# EAGLE design RADIO (EAGLE 9.4.2)
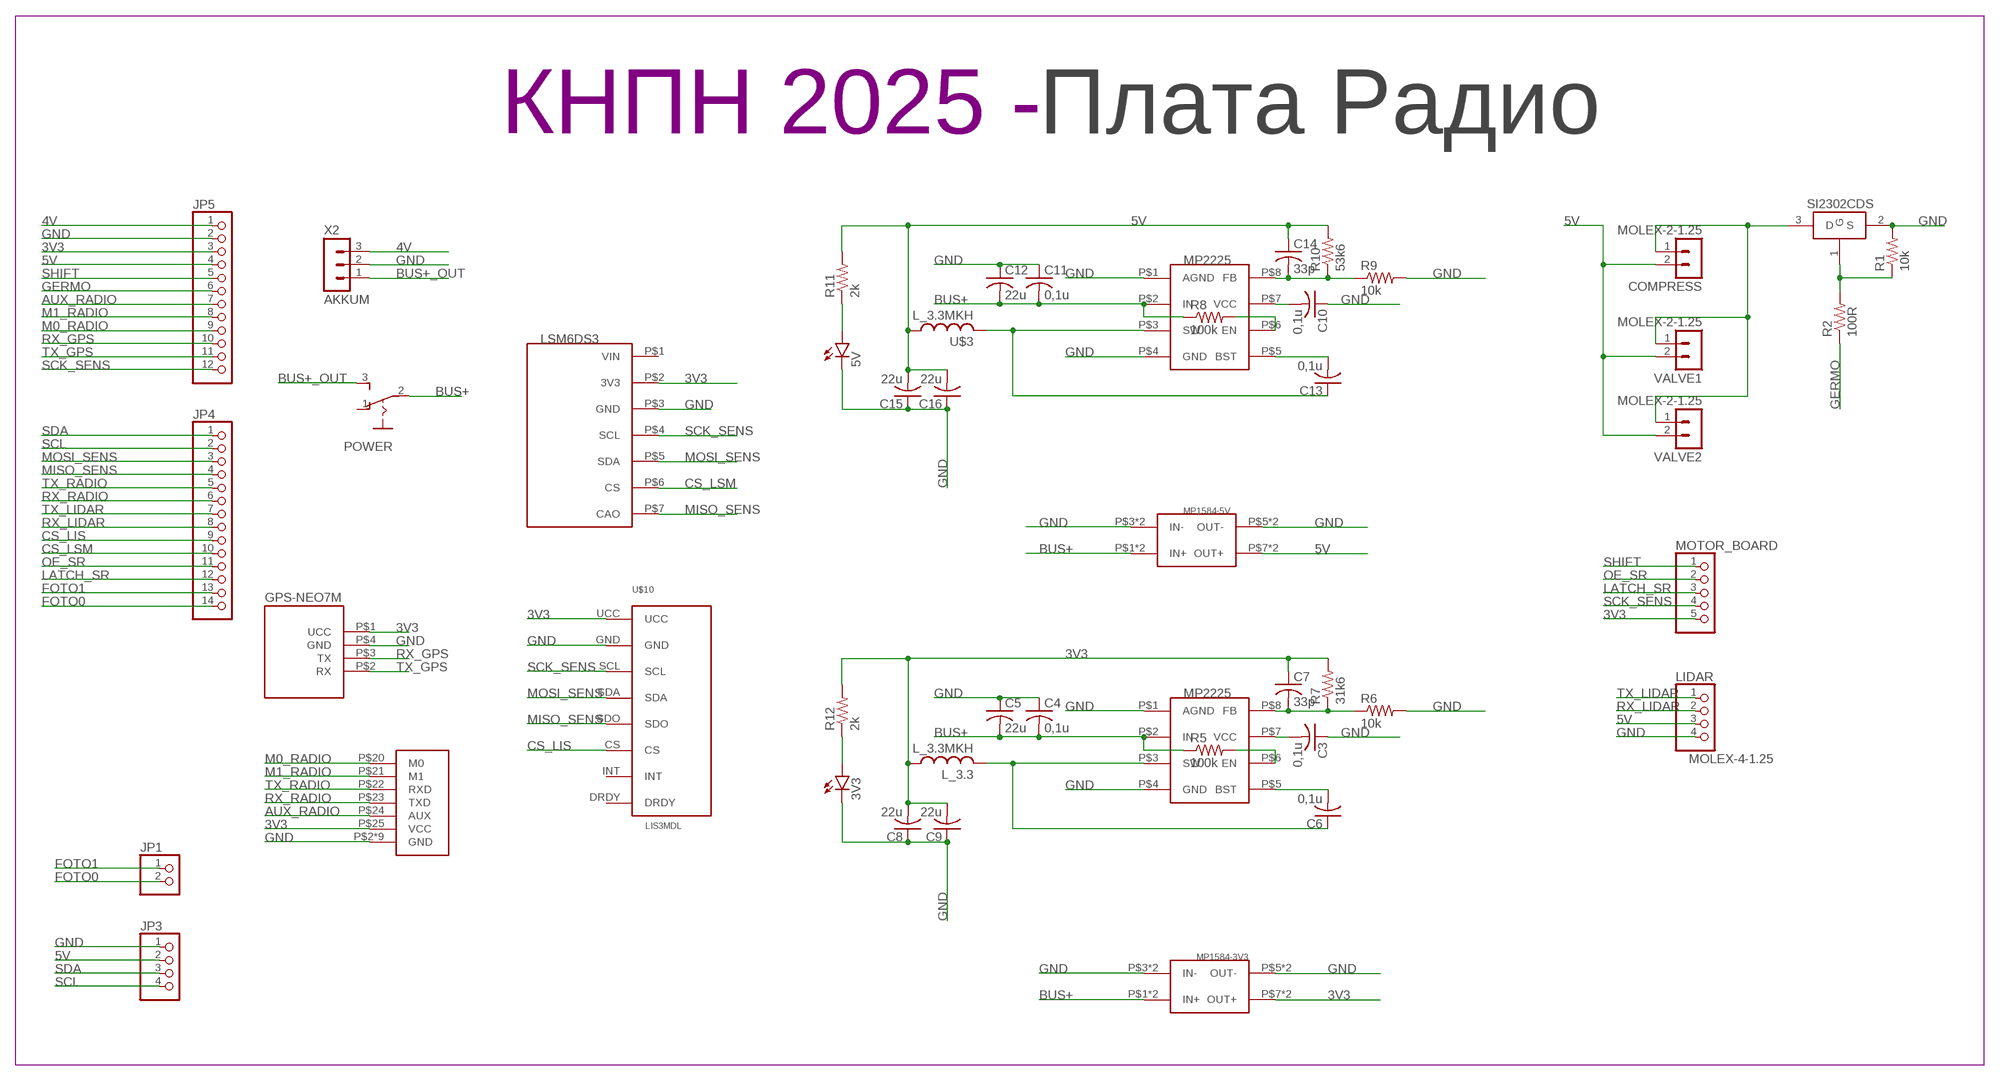
[diagram p0: schematic, sheet 1]

## Parts
3V3  LEDCHIP-LED0603  [CHIP-LED0603]
5V  LEDCHIP-LED0603  [CHIP-LED0603]
C3  0,1u  C-USC0603  [C0603]
C4  0,1u  C-USC1206  [C1206]
C5  22u  C-USC0603  [C0603]
C6  0,1u  C-USC0603  [C0603]
C7  33p  C-USC0603  [C0603]
C8  22u  C-USC1206  [C1206]
C9  22u  C-USC1206  [C1206]
C10  0,1u  C-USC0603  [C0603]
C11  0,1u  C-USC1206  [C1206]
C12  22u  C-USC0603  [C0603]
C13  0,1u  C-USC0603  [C0603]
C14  33p  C-USC0603  [C0603]
C15  22u  C-USC1206  [C1206]
C16  22u  C-USC1206  [C1206]
COMPRESS  MOLEX-2-1.25  [53047-02]
GPS-NEO7M  GPS-NEO7M  [GPS-NEO7M]
JP1  PINHD-1X2  [1X02]
JP3  PINHD-1X4  [1X04]
JP4  PINHD-1X14  [1X14]
JP5  PINHD-1X12  [1X12]
L_3.3  L_3.3MKH  L_3.3MKH_5X5  [L_SPM5020]
LIDAR  MOLEX-4-1.25  [53047-04]
LSM6DS3  LSM6DS3  LSM6DS3_WITHOUT  [LSM6DS3_WITHOUT]
MOTOR_BOARD  MOLEX-5-1.25  [53047-05]
MP1584-3V3  MP1584-B  [MP1584-B]
MP1584-5V  MP1584  MP1584-B  [MP1584-B]
POWER  UNICS-SWITCHSS_12D11  [SS_12D11]
R1  10k  R-US_R0603  [R0603]
R2  100R  R-US_R0603  [R0603]
R5  100k  R-US_R0603  [R0603]
R6  10k  R-US_R0603  [R0603]
R7  31k6  R-US_R0603  [R0603]
R8  100k  R-US_R0603  [R0603]
R9  10k  R-US_R0603  [R0603]
R10  53k6  R-US_R0603  [R0603]
R11  2k  R-US_R0603  [R0603]
R12  2k  R-US_R0603  [R0603]
RADIO  E220-400T22S  [E220-400T22S]
SI2302  SI2302CDS  [SOT23-3]
U$1  Плата Радио  LOGOPCB-""  [LOGO]
U$2  MP2225  [TSOT23-8]
U$3  L_3.3MKH  L_3.3MKH_5X5  [L_SPM5020]
U$5  MP2225  [TSOT23-8]
U$10  LIS3MDL  [LIS3MDL]
VALVE1  MOLEX-2-1.25  [53047-02]
VALVE2  MOLEX-2-1.25  [53047-02]
X2  AKKUM  JST-3-2.5  [JST-3-2.5]

## Nets
3V3: C7.1 C8.2 C9.2 GPS-NEO7M.P$1(UCC) JP5.3 L_3.3.P$1 LSM6DS3.P$2(3V3) MOTOR_BOARD.5 MP1584-3V3.P$7(OUT+) MP1584-3V3.P$8(OUT+) R7.2 R12.2 RADIO.P$25(VCC) U$10.UCC
4V: JP5.1 X2.3
5V: C14.1 C15.2 C16.2 COMPRESS.2 JP3.2 JP5.4 LIDAR.3 MP1584-5V.P$7(OUT+) MP1584-5V.P$8(OUT+) R10.2 R11.2 U$3.P$1 VALVE1.2 VALVE2.2
AUX_RADIO: JP5.7 RADIO.P$24(AUX)
BUS+: C4.2 C5.2 C11.2 C12.2 MP1584-3V3.P$1(IN+) MP1584-3V3.P$2(IN+) MP1584-5V.P$1(IN+) MP1584-5V.P$2(IN+) POWER.2(P) R5.1 R8.1 U$2.P$2(IN) U$5.P$2(IN)
BUS+_OUT: POWER.3(S) X2.1
CS_LIS: JP4.9 U$10.CS
CS_LSM: JP4.10 LSM6DS3.P$6(CS)
FOTO0: JP1.2 JP4.14
FOTO1: JP1.1 JP4.13
GERMO: JP5.6 R2.1
GND: 3V3.C 5V.C C3.1 C4.1 C5.1 C8.1 C9.1 C10.1 C11.1 C12.1 C15.1 C16.1 GPS-NEO7M.P$4(GND) JP3.1 JP5.2 LIDAR.4 LSM6DS3.P$3(GND) MP1584-3V3.P$3(IN-) MP1584-3V3.P$4(IN-) MP1584-3V3.P$5(OUT-) MP1584-3V3.P$6(OUT-) MP1584-5V.P$3(IN-) MP1584-5V.P$4(IN-) MP1584-5V.P$5(OUT-) MP1584-5V.P$6(OUT-) R1.2 R6.2 R9.2 RADIO.P$2(GND) RADIO.P$8(GND) RADIO.P$11(GND) RADIO.P$13(GND) RADIO.P$14(GND) RADIO.P$15(GND) RADIO.P$16(GND) RADIO.P$19(GND) RADIO.P$26(GND) SI2302.2(S) U$2.P$1(AGND) U$2.P$4(GND) U$5.P$1(AGND) U$5.P$4(GND) U$10.GND X2.2
LATCH_SR: JP4.12 MOTOR_BOARD.3
M0_RADIO: JP5.9 RADIO.P$20(M0)
M1_RADIO: JP5.8 RADIO.P$21(M1)
MISO_SENS: JP4.4 LSM6DS3.P$7(CAO) U$10.SDO
MOSI_SENS: JP4.3 LSM6DS3.P$5(SDA) U$10.SDA
N$2: R1.1 R2.2 SI2302.1(G)
N$5: COMPRESS.1 SI2302.3(D) VALVE1.1 VALVE2.1
N$9: C3.2 U$2.P$7(VCC)
N$10: R5.2 U$2.P$6(EN)
N$11: C6.2 U$2.P$5(BST)
N$12: C6.1 L_3.3.P$2 U$2.P$3(SW)
N$13: C7.2 R6.1 R7.1 U$2.P$8(FB)
N$14: C10.2 U$5.P$7(VCC)
N$15: R8.2 U$5.P$6(EN)
N$16: C13.2 U$5.P$5(BST)
N$17: C13.1 U$3.P$2 U$5.P$3(SW)
N$18: C14.2 R9.1 R10.1 U$5.P$8(FB)
N$19: 5V.A R11.1
N$20: 3V3.A R12.1
OE_SR: JP4.11 MOTOR_BOARD.2
RX_GPS: GPS-NEO7M.P$3(TX) JP5.10
RX_LIDAR: JP4.8 LIDAR.2
RX_RADIO: JP4.6 RADIO.P$23(TXD)
SCK_SENS: JP5.12 LSM6DS3.P$4(SCL) MOTOR_BOARD.4 U$10.SCL
SCL: JP3.4 JP4.2
SDA: JP3.3 JP4.1
SHIFT: JP5.5 MOTOR_BOARD.1
TX_GPS: GPS-NEO7M.P$2(RX) JP5.11
TX_LIDAR: JP4.7 LIDAR.1
TX_RADIO: JP4.5 RADIO.P$22(RXD)
Unconnected: LSM6DS3.P$1(VIN) POWER.1(O) U$10.DRDY U$10.INT

## Library data of the parts
3V3 5V = led:LED: LED OSRAM: - CHIPLED LG R971, LG N971, LY N971, LG Q971, LY Q971, LO R971, LY R971 LH N974, LH R974 LS Q976, LO Q976, LY Q976 LO Q996 - Hyper CHIPLED LW Q18S LB Q993, LB Q99A, LB R99A - SideLED LS A670, LO A670, LY A670, LG A670, LP A670 LB A673, LV A673, LT A673, LW A673 LH A674 LY A675 LS A676, LA A676, LO A676, LY A676, LW A676 LS A679, LY A679, LG A679 - Hyper Micro SIDELED® LS Y876, LA Y876, LO Y876, LY Y876 LT Y87S - SmartLED LW L88C, LW L88S LB L89C, LB L89S, LG L890 LS L89K, LO L89K, LY L89K LS L896, LA L896, LO L896, LY L896 - TOPLED LS T670, LO T670, LY T670, LG T670, LP T670 LSG T670, LSP T670, LSY T670, LOP T670, LYG T670 LG T671, LOG T671, LSG T671 LB T673, LV T673, LT T673, LW T673 LH T674 LS T676, LA T676, LO T676, LY T676, LB T676, LH T676, LSB T676, LW T676 LB T67C, LV T67C, LT T67C, LS T67K, LO T67K, LY T67K, LW E67C LS E67B, LA E67B, LO E67B, LY E67B, LB E67C, LV E67C, LT E67C LW T67C LS T679, LY T679, LG T679 LS T770, LO T770, LY T770, LG T770, LP T770 LB T773, LV T773, LT T773, LW T773 LH T774 LS E675, LA E675, LY E675, LS T675 LS T776, LA T776, LO T776, LY T776, LB T776 LHGB T686 LT T68C, LB T68C - Hyper Mini TOPLED® LB M676 - Mini TOPLED Santana® LG M470 LS M47K, LO M47K, LY M47K Source: http://www.osram.convergy.de LUXEON: - LUMILED® LXK2-PW12-R00, LXK2-PW12-S00, LXK2-PW14-U00, LXK2-PW14-V00 LXK2-PM12-R00, LXK2-PM12-S00, LXK2-PM14-U00 LXK2-PE12-Q00, LXK2-PE12-R00, LXK2-PE12-S00, LXK2-PE14-T00, LXK2-PE14-U00 LXK2-PB12-K00, LXK2-PB12-L00, LXK2-PB12-M00, LXK2-PB14-N00, LXK2-PB14-P00, LXK2-PB14-Q00 LXK2-PR12-L00, LXK2-PR12-M00, LXK2-PR14-Q00, LXK2-PR14-R00 LXK2-PD12-Q00, LXK2-PD12-R00, LXK2-PD12-S00 LXK2-PH12-R00, LXK2-PH12-S00 LXK2-PL12-P00, LXK2-PL12-Q00, LXK2-PL12-R00 Source: www.luxeon.com KINGBRIGHT: KA-3528ASYC Source: www.kingbright.com
C3-C16 = rcl:C-US: CAPACITOR, American symbol; SPICEPREFIX: C
COMPRESS VALVE1 VALVE2 = UNKNOWN-2024:MOLEX-2-1.25
GPS-NEO7M = UNKNOWN-2024:GPS-NEO7M
JP1 = pinhead:PINHD-1X2: PIN HEADER
JP3 = pinhead:PINHD-1X4: PIN HEADER
JP4 = pinhead:PINHD-1X14: PIN HEADER
JP5 = pinhead:PINHD-1X12: PIN HEADER
L_3.3 U$3 = CanCubeSat:L_3.3MKH_5X5
LIDAR = UNKNOWN-2024:MOLEX-4-1.25
LSM6DS3 = UNKNOWN-2024:LSM6DS3_WITHOUT
MOTOR_BOARD = UNKNOWN-2024:MOLEX-5-1.25
MP1584-3V3 MP1584-5V = UNKNOWN-2024:MP1584-B
POWER = UNKNOWN-2024:UNICS-SWITCH: SLIDING SWITCH Distributor Buerklin, 11G810
R1 R2 R5-R12 = rcl:R-US_: RESISTOR, American symbol; SPICEPREFIX: R
RADIO = UNKNOWN-2024:E220-400T22S
SI2302 = CanCubeSat:SI2302CDS
U$1 = UNKNOWN-2024:LOGO
U$2 U$5 = UNKNOWN-2024:MP2225
U$10 = UNKNOWN-2024:LIS3MDL
X2 = UNKNOWN-2024:JST-3-2.5

## Board
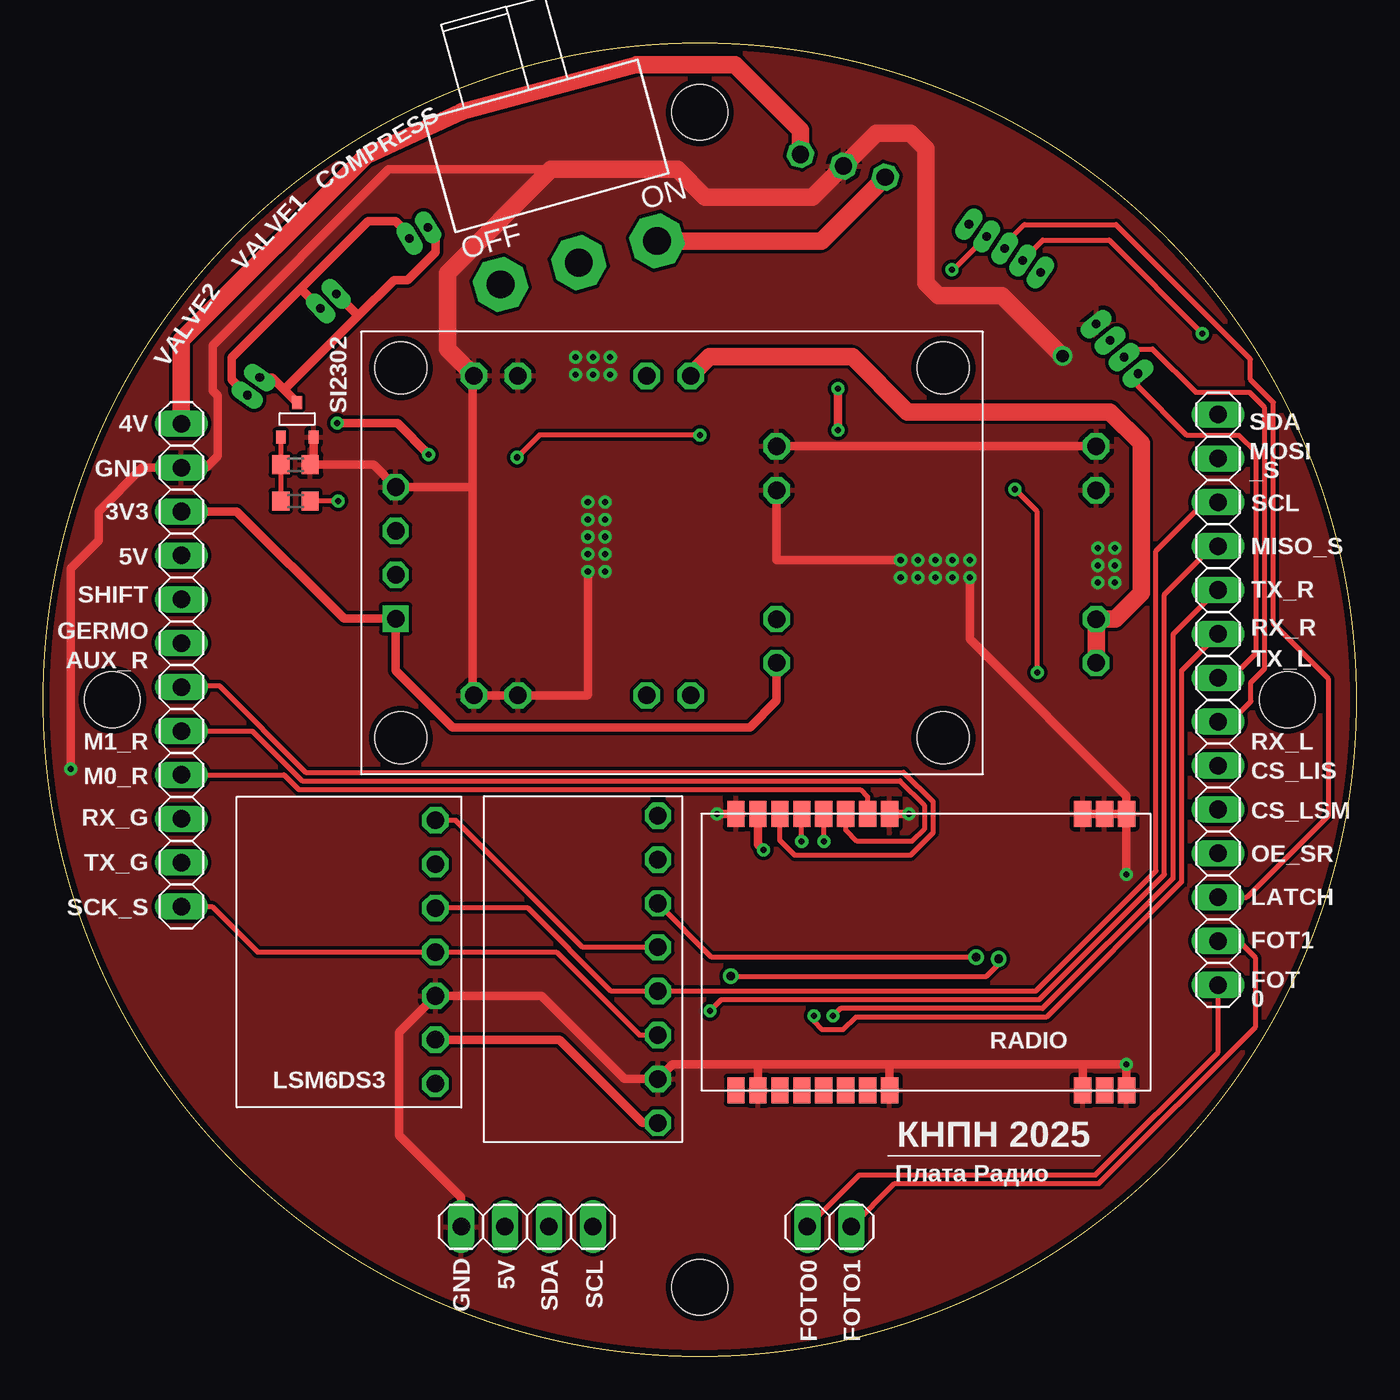
[diagram p1: board, top side]
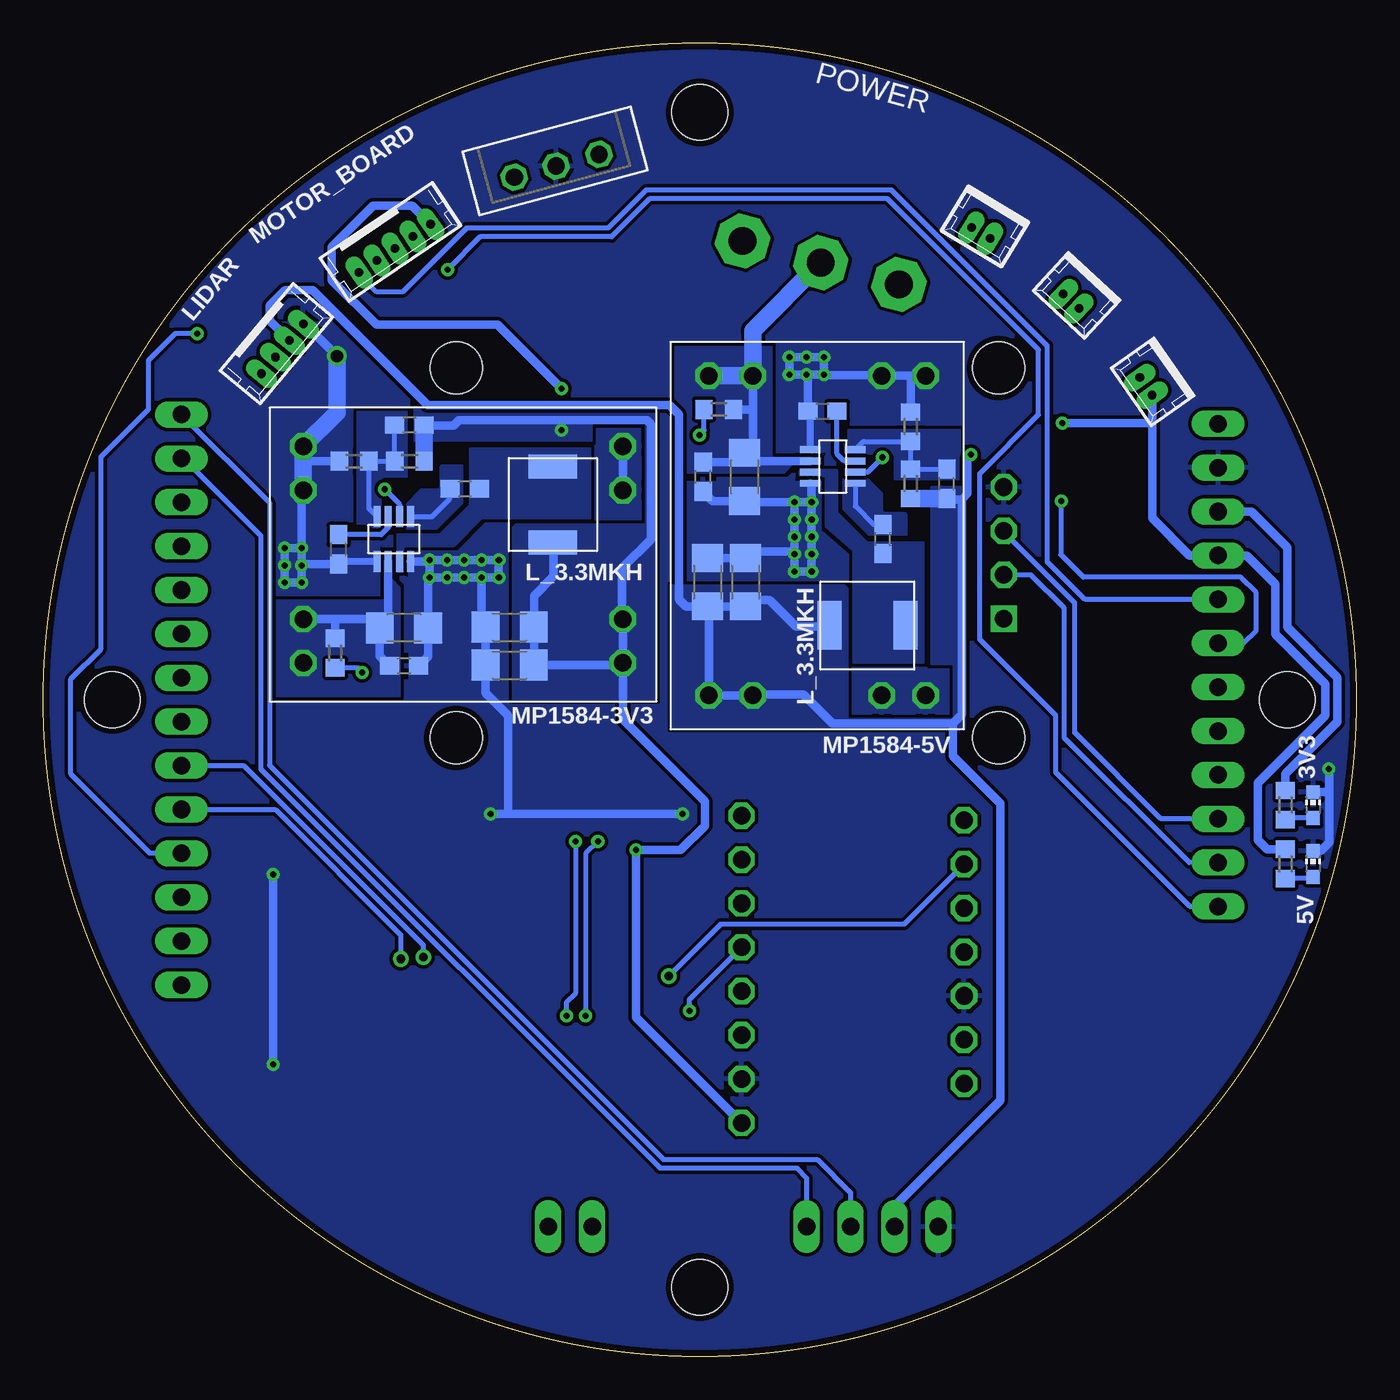
[diagram p2: board, bottom side, seen from below]

Size 76 x 76 mm. Coordinates in mm from the lower left corner, seen from the top.
Outline: circle at 38,38 radius 38
Copper layers (1*16): Top 0.035mm / dielectric 1.5mm / Bottom 0.035mm
Design rules "default *": minimum track width 0.3mm, minimum drill 0.35mm, track to track 0.2mm, track to pad 0.2mm, pad to pad 0.2mm, via to via 0.2mm, smd to smd 0.2mm, copper to edge 0.35mm, drill to drill 0.2mm, minimum pad ring 10mil, minimum via ring 8mil, stop-mask expansion 4mil, vias tented up to drill 0mil, thermal gap 10mil
Holes 3.2 mm at 38,72 72,38 38,4 4,38

### Footprints (pad centres in the part's own frame; a part is rotated, then mirrored left to right if it is on the bottom)
CHIP-LED0603 = smd 0.8 x 0.8: A 0,-0.75; C 0,0.75
C0603 = smd 1.1 x 1: 1 -0.85,0; 2 0.85,0
C1206 = smd 1.6 x 1.8: 1 -1.4,0; 2 1.4,0
53047-02 = drill 0.5 pad 0.698 long: 1 0.625,0.45; 2 -0.625,0.45
GPS-NEO7M = drill 1.016 square: P$1 -3.81,16 | drill 1.016 octagon: P$2 -1.27,16; P$3 1.27,16; P$4 3.81,16 | hole 3: -10.7,15.7; 10.7,15.7; 10.7,-15.7; -10.7,-15.7
1X02 = drill 1.016 long: 1 -1.27,0; 2 1.27,0
1X04 = drill 1.016 long: 1 -3.81,0; 2 -1.27,0; 3 1.27,0; 4 3.81,0
1X14 = drill 1.016 long: 1 -16.51,0; 2 -13.97,0; 3 -11.43,0; 4 -8.89,0; 5 -6.35,0; 6 -3.81,0; 7 -1.27,0; 8 1.27,0; 9 3.81,0; 10 6.35,0; 11 8.89,0; 12 11.43,0; 13 13.97,0; 14 16.51,0
1X12 = drill 1.016 long: 1 -13.97,0; 2 -11.43,0; 3 -8.89,0; 4 -6.35,0; 5 -3.81,0; 6 -1.27,0; 7 1.27,0; 8 3.81,0; 9 6.35,0; 10 8.89,0; 11 11.43,0; 12 13.97,0
L_SPM5020 = smd 1.4 x 2.8: P$1 -2.2,0; P$2 2.2,0
53047-04 = drill 0.5 pad 0.698 long: 1 1.875,0.45; 2 0.625,0.45; 3 -0.625,0.45; 4 -1.875,0.45
LSM6DS3_WITHOUT = drill 1.016 octagon: P$1 -7.62,-5; P$2 -5.08,-5; P$3 -2.54,-5; P$4 0,-5; P$5 2.54,-5; P$6 5.08,-5; P$7 7.62,-5
53047-05 = drill 0.5 pad 0.698 long: 1 2.5,0.45; 2 1.25,0.45; 3 0,0.45; 4 -1.25,0.45; 5 -2.5,0.45
MP1584-B = drill 1.016 octagon: P$1 -9.25,-6.27; P$2 -9.25,-3.73; P$3 -9.25,3.73; P$4 -9.25,6.27; P$5 9.25,6.27; P$6 9.25,3.73; P$7 9.25,-3.73; P$8 9.25,-6.27
SS_12D11 = drill 1.6 pad 3 octagon: 1 -4.7,0; 2 0,0; 3 4.7,0
R0603 = smd 1 x 1.1: 1 -0.85,0; 2 0.85,0
E220-400T22S = smd 1.5 x 1: P$1 -8,11; P$2 -8,9.73; P$3 -8,8.46; P$4 -8,7.19; P$5 -8,5.92; P$6 -8,4.65; P$7 -8,3.38; P$8 -8,2.11; P$11 -8,-9.06; P$12 -8,-10.33; P$13 -8,-11.6; P$14 8,-11.6; P$15 8,-10.33; P$16 8,-9.06; P$19 8,2.11; P$20 8,3.38; P$21 8,4.65; P$22 8,5.92; P$23 8,7.19; P$24 8,8.46; P$25 8,9.73; P$26 8,11
SOT23-3 = smd 0.56 x 0.73: 1 -0.95,-1; 2 0.95,-1; 3 0,1
TSOT23-8 = smd 0.4 x 1.2: P$1 -0.975,-1.3; P$2 -0.325,-1.3; P$3 0.325,-1.3; P$4 0.975,-1.3; P$5 0.975,1.3; P$6 0.325,1.3; P$7 -0.325,1.3; P$8 -0.975,1.3
LIS3MDL = drill 1.016 octagon: CS -5.08,-3.81; DRDY -5.08,-8.89; GND -5.08,6.35; INT -5.08,-6.35; SCL -5.08,3.81; SDA -5.08,1.27; SDO -5.08,-1.27; UCC -5.08,8.89
JST-3-2.5 = drill 1 pad 1.5 octagon: 1 2.52,0; 2 0.02,0; 3 -2.56,0

### Placement (x,y rotation side)
3V3  2.5,31.9 0 bottom
5V  2.5,28.5 0 bottom
C3  58.9,46.7 90 bottom
C4  35.4,50.9 90 bottom
C5  37.8,50.9 90 bottom
C6  51.6,50.2 180 bottom
C7  54.8,53.9 180 bottom
C8  49,42.2 0 bottom
C9  49,40 0 bottom
C10  30.9,54.7 0 bottom
C11  55.12,42.16 180 bottom
C12  55.11,39.96 180 bottom
C13  27.4,47.3 90 bottom
C14  23.7,50.5 90 bottom
C15  37.55,44.8 270 bottom
C16  35.35,44.8 270 bottom
COMPRESS  21.5,65.4 149 bottom
GPS-NEO7M  36.4,46.5 90 top
JP1  45.5,7.5 180 top
JP3  28,7.5 0 top
JP4  68,38 270 top
JP5  8,40 270 top
L_3.3  46.5,49.3 90 bottom
LIDAR  62.5,58.6 230 bottom
LSM6DS3  17.7,23.4 90 top
MOTOR_BOARD  55.9,64.5 214 bottom
MP1584-3V3  51.7,46.4 0 bottom
MP1584-5V  31.2,47.5 270 bottom
POWER  31,63.3 15.5 top
R1  14.6,51.6 0 top
R2  14.6,49.5 180 top
R5  59.1,40.7 270 bottom
R6  58,51.8 180 bottom
R7  54.8,51.8 0 bottom
R8  36.9,54.8 180 bottom
R9  25.8,53.8 90 bottom
R10  25.8,50.5 270 bottom
R11  4.1,28.5 90 bottom
R12  4.1,31.9 90 bottom
RADIO  51.1,23.4 90 top
SI2302  14.7,54.2 0 top
U$1  48.9,11.6 0 top
U$2  55.7,47.3 0 bottom
U$3  28.3,42.3 0 bottom
U$5  30.3,51.5 270 bottom
U$10  30.5,22.4 180 top
VALVE1  16.2,61.4 137 bottom
VALVE2  11.8,56.4 125 bottom
X2  46.3,68.9 195 bottom

### Tracks (layer width: path | path; a pad name or v marks a point on that pad's centre or on a via)
3V3  (via drill 0.35)
  Top 0.5: LSM6DS3.P$2 29.88,18.32 34.69,13.51 U$10.UCC | v41.7,29.3 41.37,29.63 RADIO.P$25 | JP5.3 11.21,48.89 17.41,42.69 GPS-NEO7M.P$1 20.4,39.7 23.7,36.4 40.9,36.4 42.45,37.95 MP1584-3V3.P$8 | v46,53.6 v46,56
  Bottom 0.5: 46,54.18 41.05,54.18 40.83,53.96 40.83,47.28 42.5,45.61 42.5,42.72 MP1584-3V3.P$7 MP1584-3V3.P$8 | 46,54.18 51.93,54.18 52.25,53.86 53.91,53.86 C7.1 | R12.2 4.1,33.7 1.1,36.7 1.1,39.3 4,42.2 4,46.8 6.09,48.89 JP5.3 | U$10.UCC 41.7,19.63 v41.7,29.3 39.1,29.3 37.7,30.7 37.7,32.1 42.45,36.85 MP1584-3V3.P$8 | MOTOR_BOARD.5 54.65,66.6 56.9,66.6 59.3,64.2 59.3,62.3 56.7,59.7 49.7,59.7 v46,56 | 46,54.18 v46,53.6 | L_3.3.P$1 46.45,47.05 46.45,45.16 47.6,44.01 C8.2 C9.2 42.58,40 MP1584-3V3.P$8
  Bottom 1: R7.2 C7.1
  pour Bottom (rank 2, no thermals): 48.83,47.98 48.83,37.98 40.53,37.98 40.53,54.98 54.53,54.98 54.53,52.98 44.23,52.98 44.23,54.28 41.13,54.28 41.13,48.18 48.63,48.18
4V
  Top 1: X2.3 43.83,70.97 40.04,74.76 34.34,74.76 24.21,72.04 18.65,69.45 8,58.8 JP5.1
5V  (via drill 0.35)
  Top 0.5: VALVE2.2 10.9,56.54 10.9,57.8 14.9,61.8 | COMPRESS.2 21.2,64.9 20.4,65.7 18.8,65.7 14.9,61.8 | VALVE1.2 14.9,61.79 14.9,61.8 | v17,54 20.5,54 v22.3,52.2
  Bottom 0.5: R11.2 5.15,29.35 5.7,29.9 5.7,33.19 1.8,37.09 1.8,38.91 4.7,41.81 4.7,44.7 6.35,46.35 JP5.4 9.65,46.35 11.81,48.51 11.81,54 | C15.2 38.8,43.4 39.2,43.8 39.2,54.5 39.75,55.05 53.75,55.05 60.4,61.7 62,61.7 62.9,60.8 62.9,59.94 LIDAR.3 | JP3.2 26.73,8.67 20.6,14.8 20.6,32 23.35,34.75 23.35,36.62 | 11.81,54 VALVE2.2 | 22.82,49.6 22.82,37.15 23.35,36.62 | 11.81,54 v17,54 | v22.3,52.2 22.5,52 22.5,49.92 22.82,49.6 | C15.2 C16.2 34.98,43.77 33.96,43.77 32.44,42.25 30.55,42.25 U$3.P$1 | C15.2 37.47,43.32 MP1584-5V.P$8 MP1584-5V.P$7 34.88,38.3 31.99,38.3 30.32,36.63 24.42,36.63 24.43,36.62 23.35,36.62 | 22.82,49.6 23.65,49.6 C14.1
  Bottom 1: C14.1 R10.2
  pour Bottom (rank 2, no thermals): 29.62,44.63 39.62,44.63 39.62,36.33 22.62,36.33 22.62,50.33 24.62,50.33 24.62,40.03 23.32,40.03 23.32,36.93 29.42,36.93 29.42,44.43
AUX_RADIO
  Top 0.3: JP5.7 8.07,38.8 10.2,38.8 15.2,33.8 49.8,33.8 51.5,32.1 51.5,30.3 50.2,29 43.5,29 42.64,29.86 RADIO.P$24
BUS+
  Top 1: MP1584-3V3.P$1 MP1584-3V3.P$2 62.05,42.67 63.55,44.16 63.55,52.85 61.75,54.65 50.03,54.65 46.83,57.85 38.57,57.85 MP1584-5V.P$1
  Bottom 0.5: MP1584-3V3.P$2 59.1,42.67 | R5.1 59.1,42.67 | C12.2 56.52,40.52 C11.2 | 59.1,42.67 57.03,42.67 C11.2 | U$2.P$2 56.02,42.66 C11.2 | U$5.P$2 34.92,51.83 C4.2 | C5.2 35.95,51.75 C4.2 | MP1584-5V.P$2 34.93,54.8 | 34.93,54.8 34.93,52.77 C4.2 | R8.1 34.93,54.8
  Bottom 1: POWER.2 34.93,59.37 MP1584-5V.P$2 MP1584-5V.P$1
  pour Bottom (rank 2, no thermals): 62.63,43.78 62.63,38.18 55.33,38.18 55.33,44.48 55.83,44.98 55.83,46.58 56.23,46.58 56.23,43.78
  pour Bottom (rank 2, no thermals): 33.82,58.43 39.42,58.43 39.42,51.13 33.12,51.13 32.62,51.63 31.02,51.63 31.02,52.03 33.82,52.03
BUS+_OUT
  Top 1: POWER.3 45.04,64.56 X2.1
CS_LIS  (via drill 0.5)
  Top 0.3: v54,23.1 38.69,23.1 U$10.CS
  Bottom 0.3: v54,23.1 54,23.8 64.39,34.19 JP4.9
CS_LSM  (via drill 0.5)
  Top 0.3: v39.8,22 54.6,22 55.3,22.7 v55.3,23
  Bottom 0.3: LSM6DS3.P$6 26.18,25 36.8,25 v39.8,22 | v55.3,23 55.3,24.39 62.56,31.65 JP4.10
FOTO0
  Top 0.3: JP1.2 47.23,10.5 60.9,10.5 68,17.6 JP4.14
FOTO1
  Top 0.3: JP1.1 49.27,10 61.11,10 70.17,19.07 70.17,23.05 69.19,24.03 JP4.13
GERMO  (via drill 0.35)
  Top 0.3: v17.07,49.5 R2.1
  Bottom 0.3: JP5.6 6.53,41.27 5.8,42 5.8,44.2 6.7,45.1 15.8,45.1 17.1,46.4 17.1,49.47 v17.07,49.5
GND  (via drill 0.35, 0.7)
  Top 0.5: v49.63,46.08 42.43,46.08 42.43,50.11 MP1584-3V3.P$6 | v31.52,45.43 31.52,38.3 31.47,38.25 MP1584-5V.P$6 MP1584-5V.P$5 24.85,38.33 24.85,50.3 24.84,50.31 | RADIO.P$14 RADIO.P$15 RADIO.P$16 | SI2302.2 15.65,51.8 R1.2 19.11,51.6 GPS-NEO7M.P$4 24.84,50.31 | RADIO.P$19 v50.1,31.4 | v39,31.4 RADIO.P$26 | JP3.1 24.19,9.21 20.6,12.8 20.6,18.76 LSM6DS3.P$3 28.84,20.86 33.65,16.05 U$10.GND 36.43,16.9 41.4,16.9 | v1.6,34 1.6,45.6 3.2,47.2 3.2,48.9 5.73,51.43 JP5.2 9.43,51.43 10.1,52.1 10.1,55.6 9.8,55.9 9.8,58.5 20,68.7 29.4,68.7 | RADIO.P$14 v62.7,27.9 | MP1584-3V3.P$5 MP1584-3V3.P$4 | RADIO.P$13 v62.7,16.9 60.2,16.9 | 60.2,16.9 49,16.9 | 49,16.9 41.4,16.9 | RADIO.P$11 60.16,16.86 60.2,16.9 | RADIO.P$8 48.99,16.89 49,16.9 | RADIO.P$2 41.37,16.87 41.4,16.9 | 24.84,50.31 24.84,56.66 MP1584-5V.P$4 | RADIO.P$14 62.7,32.44 53.63,41.51 v53.63,45.08
  Top 1: MP1584-5V.P$4 23.4,58.28 23.4,62.7 29.4,68.7 36.7,68.7 38.3,67.1 44.52,67.1 X2.2 48.22,70.8 50.2,70.8 51.1,69.9 51.1,62.1 51.8,61.4 55.5,61.4 v59,57.9
  Bottom 0.4: U$2.P$1 58.75,46 | U$5.P$1 31.6,54.55
  Bottom 0.5: v50.63,45.08 v49.63,45.08 v49.63,46.08 v50.63,46.08 v51.63,46.08 v52.63,46.08 v53.63,46.08 | v53.63,45.08 v53.63,46.08 | v50.63,45.08 v51.63,45.08 v52.63,45.08 v53.63,45.08 | v61.03,45.78 v61.03,44.78 v62.03,44.78 v62.03,45.78 v62.03,46.78 v61.03,46.78 | v61.03,45.78 v61.03,46.78 | v32.52,46.43 32.66,46.57 34.98,46.57 C16.1 C15.1 | v32.52,46.43 v32.52,45.43 v31.52,45.43 v31.52,46.43 v31.52,47.43 v31.52,48.43 v31.52,49.43 | v32.52,49.43 v31.52,49.43 | v32.52,46.43 v32.52,47.43 v32.52,48.43 v32.52,49.43 | v31.82,56.83 v32.82,56.83 v32.82,57.83 v31.82,57.83 v30.82,57.83 v30.82,56.83 | v31.82,56.83 v30.82,56.83 | v30.82,56.83 30.77,56.78 27.5,56.78 MP1584-5V.P$3 25.79,56.75 | v50.1,31.4 49.1,31.4 | 49.1,31.4 v39,31.4 | 5V.C 2.05,29.25 1.56,29.73 1.56,32.65 | 3V3.C 1.56,32.65 | R9.2 25.79,56.75 | v59,57.9 60.85,59.75 LIDAR.4 | 1.56,32.65 1.56,33.97 v1.6,34 | 49.1,31.4 49.1,37.1 50.4,38.4 C9.1 C8.1 50.63,42.43 v50.63,45.08 | v62.7,27.9 v62.7,16.9 | C5.1 37.25,49.5 C4.1 35.33,49.43 v32.52,49.43 | R6.2 60.95,51.8 | v61.03,46.78 61.03,50.05 MP1584-3V3.P$3 | v61.03,45.78 60.96,45.85 C3.1 58.75,46 | U$2.P$4 53.71,46 v53.63,46.08 | C12.1 53.72,40.5 C11.1 53.72,44.99 v53.63,45.08 | v31.52,49.43 31.52,50.45 U$5.P$4 | 31.6,54.55 C10.1 31.75,56.76 v31.82,56.83 | MP1584-3V3.P$5 MP1584-3V3.P$6 | 25.79,56.75 MP1584-5V.P$4
  Bottom 1: v59,57.9 59,54.62 MP1584-3V3.P$4 60.95,51.8 MP1584-3V3.P$3
  pour Bottom (rank 3): -4.8,80 84.2,80 84.2,-1.1 -4.8,-1.1
  pour Bottom (rank 2, no thermals): 43.63,53.78 41.43,53.78 41.43,48.98 43.63,48.98
  pour Bottom (rank 2, no thermals): 58.13,54.68 58.13,48.48 59.83,48.48 59.83,46.88 56.53,46.88 56.53,44.08 62.63,44.08 62.63,54.68
  pour Bottom (rank 2, no thermals): 49.13,48.08 49.13,38.28 54.83,38.28 54.83,46.58 51.93,46.58 50.43,48.08
  pour Bottom (rank 2, no thermals): 23.82,39.43 23.82,37.23 28.62,37.23 28.62,39.43
  pour Bottom (rank 2, no thermals): 22.92,53.93 29.12,53.93 29.12,55.63 30.72,55.63 30.72,52.33 33.52,52.33 33.52,58.43 22.92,58.43
  pour Bottom (rank 2, no thermals): 29.52,44.93 39.32,44.93 39.32,50.63 31.02,50.63 31.02,47.73 29.52,46.23
  pour Top: -4.7,80.1 84.3,80.1 84.3,-1 -4.7,-1
LATCH_SR
  Top 0.3: JP4.12 69.66,26.57 74.4,31.31 74.4,39.2 71.2,42.4 71.2,55.21 69.87,56.53 69.87,57.71 62.08,65.5 56.8,65.5 55.65,64.35 MOTOR_BOARD.3
M0_RADIO
  Top 0.3: JP5.9 13.94,33.65 14.79,32.8 47.3,32.8 47.72,32.38 RADIO.P$20
M1_RADIO
  Top 0.3: JP5.8 12.1,36.19 14.99,33.3 49.59,33.3 51,31.9 51,30.5 50.29,29.8 47.1,29.8 46.45,30.45 RADIO.P$21
MISO_SENS  (via drill 0.35)
  Top 0.3: U$10.SDO 31.23,23.67 23.88,31.02 LSM6DS3.P$7 | v38.6,20 39.23,20.63 57.64,20.63 64.9,27.89 64.9,44.1 67.69,46.89 JP4.4
  Bottom 0.3: v38.6,20 38.6,20.65 U$10.SDO
MOSI_SENS
  Top 0.3: LSM6DS3.P$5 28.06,25.94 32.87,21.13 U$10.SDA 57.43,21.13 64.4,28.1 64.4,46.6 67.23,49.43 JP4.3
N$2
  Top 0.3: SI2302.1 R1.1 R2.2
N$5
  Top 0.5: SI2302.3 13.95,55.95 | 13.95,55.95 13.25,56.65 VALVE2.1 | COMPRESS.1 22.7,64.9 22.7,63.9 21.1,62.3 20.3,62.3 18.2,60.2 | 18.2,60.2 13.95,55.95 | VALVE1.1 18.2,60.26 18.2,60.2
N$9
  Bottom 0.3: U$2.P$7 56.02,47.95 56.43,47.55 C3.2
N$10  (via drill 0.35)
  Top 0.3: v57.53,39.58 57.53,48.88 v56.23,50.18
  Bottom 0.3: v57.53,39.58 57.8,39.85 R5.2 | U$2.P$6 55.38,49.33 v56.23,50.18
N$11
  Bottom 0.3: U$2.P$5 53.5,48.6 52.45,49.65 C6.2
  pour Bottom (rank 2, no thermals): 51.73,51.58 51.73,49.38 53.23,47.88 55.03,47.88 55.03,49.28 54.13,50.18 53.13,50.18 53.03,50.28 53.03,51.48 52.93,51.58
N$12
  pour Bottom (rank 2, no thermals): 44.33,52.58 44.33,48.48 50.63,48.48 52.23,46.88 55.13,46.88 55.13,45.38 55.53,45.38 55.53,47.58 53.03,47.58 51.33,49.28 51.33,52.58
N$13
  Bottom 0.3: U$2.P$8 57.15,49.08 R6.1 R7.1 C7.2
  pour Bottom (rank 2, no thermals): 54.93,54.68 57.83,54.68 57.83,48.18 57.13,48.18 56.93,47.98 56.43,47.98 56.43,49.58 56.63,49.78 56.63,50.58 56.33,50.88 54.93,50.88
N$14
  Bottom 0.3: U$5.P$7 29.65,51.83 30.05,52.23 C10.2
N$15  (via drill 0.35)
  Top 0.3: v38.02,53.33 28.72,53.33 v27.42,52.03
  Bottom 0.3: v38.02,53.33 37.75,53.6 R8.2 | U$5.P$6 28.27,51.17 v27.42,52.03
N$16
  Bottom 0.3: U$5.P$5 29,49.2 27.95,48.15 C13.2
  pour Bottom (rank 2, no thermals): 26.02,47.53 28.22,47.53 29.72,49.03 29.72,50.83 28.32,50.83 27.42,49.93 27.42,48.93 27.32,48.83 26.12,48.83 26.02,48.73
N$17
  pour Bottom (rank 2, no thermals): 25.02,40.13 29.12,40.13 29.12,46.63 30.72,48.03 30.72,50.93 32.22,50.93 32.22,51.33 30.02,51.33 30.02,48.83 28.32,47.13 25.02,47.13
N$18
  Bottom 0.3: U$5.P$8 28.52,52.95 R9.1 R10.1 C14.2
  pour Bottom (rank 2, no thermals): 22.92,50.73 22.92,53.63 29.42,53.63 29.42,52.93 29.62,52.73 29.62,52.23 28.02,52.23 27.82,52.43 27.02,52.43 26.72,52.13 26.72,50.73
N$19
  Bottom 0.3: 5V.A 2.6,27.65 R11.1
N$20
  Bottom 0.3: 3V3.A 4,31.15 R12.1
OE_SR  (via drill 0.35)
  Top 0.3: MOTOR_BOARD.2 57.86,64.6 61.7,64.6 v67.1,59.2
  Bottom 0.3: JP4.11 69.81,29.11 74.4,33.7 74.4,39.2 72.65,40.95 72.65,52.07 69.92,54.8 69.92,57.64 68.36,59.2 v67.1,59.2
RX_GPS
  Bottom 0.3: JP5.10 11.31,31.11 16.3,36.1 16.3,43.6 20.4,47.7 GPS-NEO7M.P$3
RX_LIDAR
  Top 0.3: LIDAR.2 63.03,58.3 64.2,58.3 66.7,55.8 69.8,55.8 70.7,54.9 70.7,39.8 69.9,39 69.9,37.9 68.73,36.73 JP4.8
RX_RADIO  (via drill 0.35)
  Top 0.3: v44.6,19.7 44.6,19.4 45.1,18.9 46.3,18.9 47.03,19.63 58.05,19.63 65.9,27.48 65.9,39.7 JP4.6 | v43.9,29.8 RADIO.P$23
  Bottom 0.3: v43.9,29.8 44.6,29.1 v44.6,19.7
SCK_SENS  (via drill 0.35)
  Top 0.3: U$10.SCL 34.51,18.59 29.7,23.4 LSM6DS3.P$4 12.4,23.4 9.77,26.03 JP5.12 | v52.6,62.9 52.69,62.9 MOTOR_BOARD.4
  Bottom 0.3: JP5.12 9.63,26.03 17.4,33.8 17.4,37.1 21.8,41.5 21.8,51.1 18.4,54.5 18.4,58.26 27.13,67 40.9,67 43.09,64.8 50.7,64.8 v52.6,62.9
SCL
  Bottom 0.3: JP3.4 31.81,10.31 32.4,10.9 40.31,10.9 63.4,33.99 63.4,47.5 67.87,51.97 JP4.2
SDA
  Bottom 0.3: JP3.3 29.27,9.47 31.2,11.4 40.1,11.4 62.9,34.2 62.9,49.41 JP4.1
SHIFT
  Bottom 0.3: JP5.5 15.71,43.81 17.9,46 17.9,58.5 26.9,67.5 41.1,67.5 43.3,65.3 51.5,65.3 55.2,61.6 56.7,61.6 57.72,62.62 MOTOR_BOARD.1
TX_GPS
  Bottom 0.3: JP5.11 9.67,28.57 16.9,35.8 16.9,43.3 18.83,45.23 GPS-NEO7M.P$2
TX_LIDAR
  Top 0.3: LIDAR.1 63.36,56.14 66.2,53.3 69.2,53.3 70.2,52.3 70.2,40.7 68.77,39.27 JP4.7
TX_RADIO  (via drill 0.35)
  Top 0.3: v45.7,19.7 46.13,20.13 57.84,20.13 65.4,27.69 65.4,41.8 67.95,44.35 JP4.5 | v45.2,29.8 45.2,31.38 RADIO.P$22
  Bottom 0.3: v45.2,29.8 45.2,21 45.7,20.5 v45.7,19.7

### Text on the board
tNames: 4V | SDA | GND | MOSI / _S | 3V3 | SCL | 5V | MISO_S | SHIFT | TX_R | GERMO | RX_R | AUX_R | TX_L | M1_R | RX_L | M0_R | CS_LIS | RX_G | CS_LSM | TX_G | OE_SR | SCK_S | LATCH | FOT1 | FOT / 0 | GND | 5V | SDA | SCL | FOTO0 | FOTO1